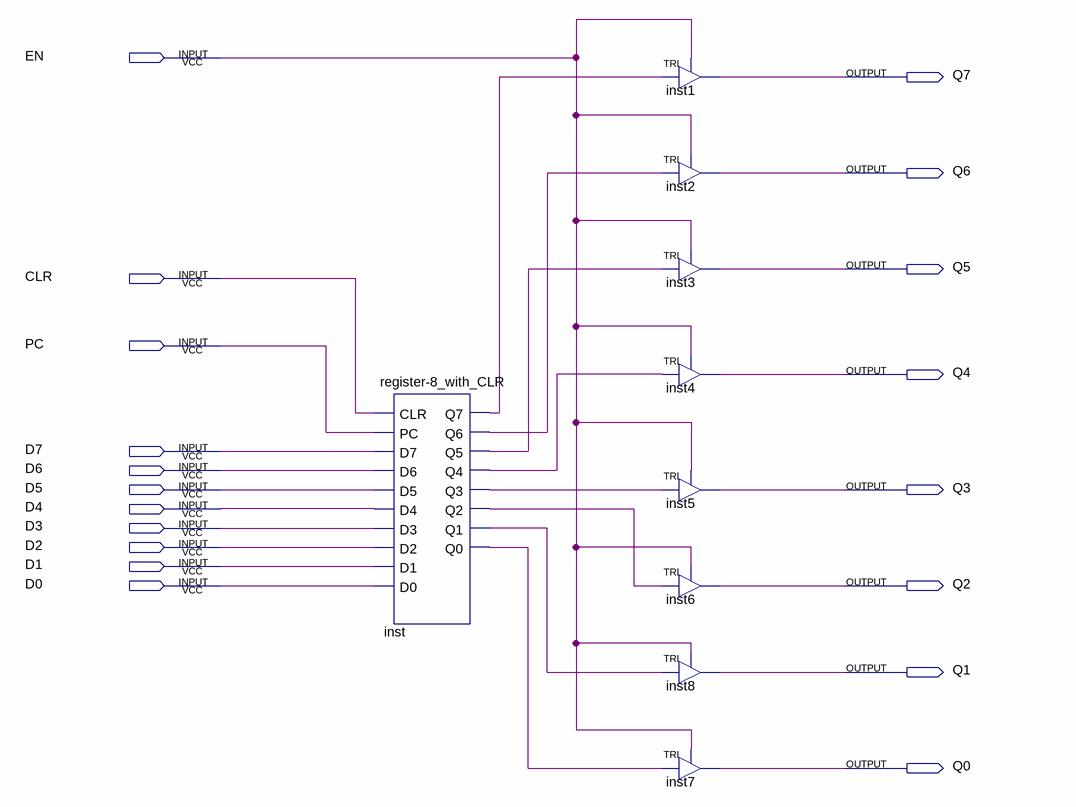
[diagram p0: schematic sheet]
// Quartus schematic MBR-with-tri.bdf as structural Verilog: 9 symbols, 19 pins
module \MBR-with-tri  (
  input  EN,
  input  CLR,
  input  PC,
  input  D7,
  input  D6,
  input  D5,
  input  D4,
  input  D3,
  input  D2,
  input  D1,
  input  D0,
  output Q7,
  output Q6,
  output Q5,
  output Q4,
  output Q3,
  output Q2,
  output Q1,
  output Q0
);

  wire inst_q0, inst_q1, inst_q2, inst_q3, inst_q4, inst_q5, inst_q6, inst_q7;

  \register-8_with_CLR  inst (
    .CLR(CLR), .PC(PC), .D7(D7), .D6(D6), .D5(D5), .D4(D4), .D3(D3), .D2(D2), .D1(D1), .D0(D0), .Q7(inst_q7),
    .Q6(inst_q6), .Q5(inst_q5), .Q4(inst_q4), .Q3(inst_q3), .Q2(inst_q2), .Q1(inst_q1), .Q0(inst_q0));
  TRI inst1 (.IN(inst_q7), .OE(EN), .OUT(Q7));
  TRI inst2 (.IN(inst_q6), .OE(EN), .OUT(Q6));
  TRI inst3 (.IN(inst_q5), .OE(EN), .OUT(Q5));
  TRI inst4 (.IN(inst_q4), .OE(EN), .OUT(Q4));
  TRI inst5 (.IN(inst_q3), .OE(EN), .OUT(Q3));
  TRI inst6 (.IN(inst_q2), .OE(EN), .OUT(Q2));
  TRI inst8 (.IN(inst_q1), .OE(EN), .OUT(Q1));
  TRI inst7 (.IN(inst_q0), .OE(EN), .OUT(Q0));
endmodule
